# Altium schematic sheet Schematic .SchDoc
size B; SheetNumber: 1; SheetTotal: 1
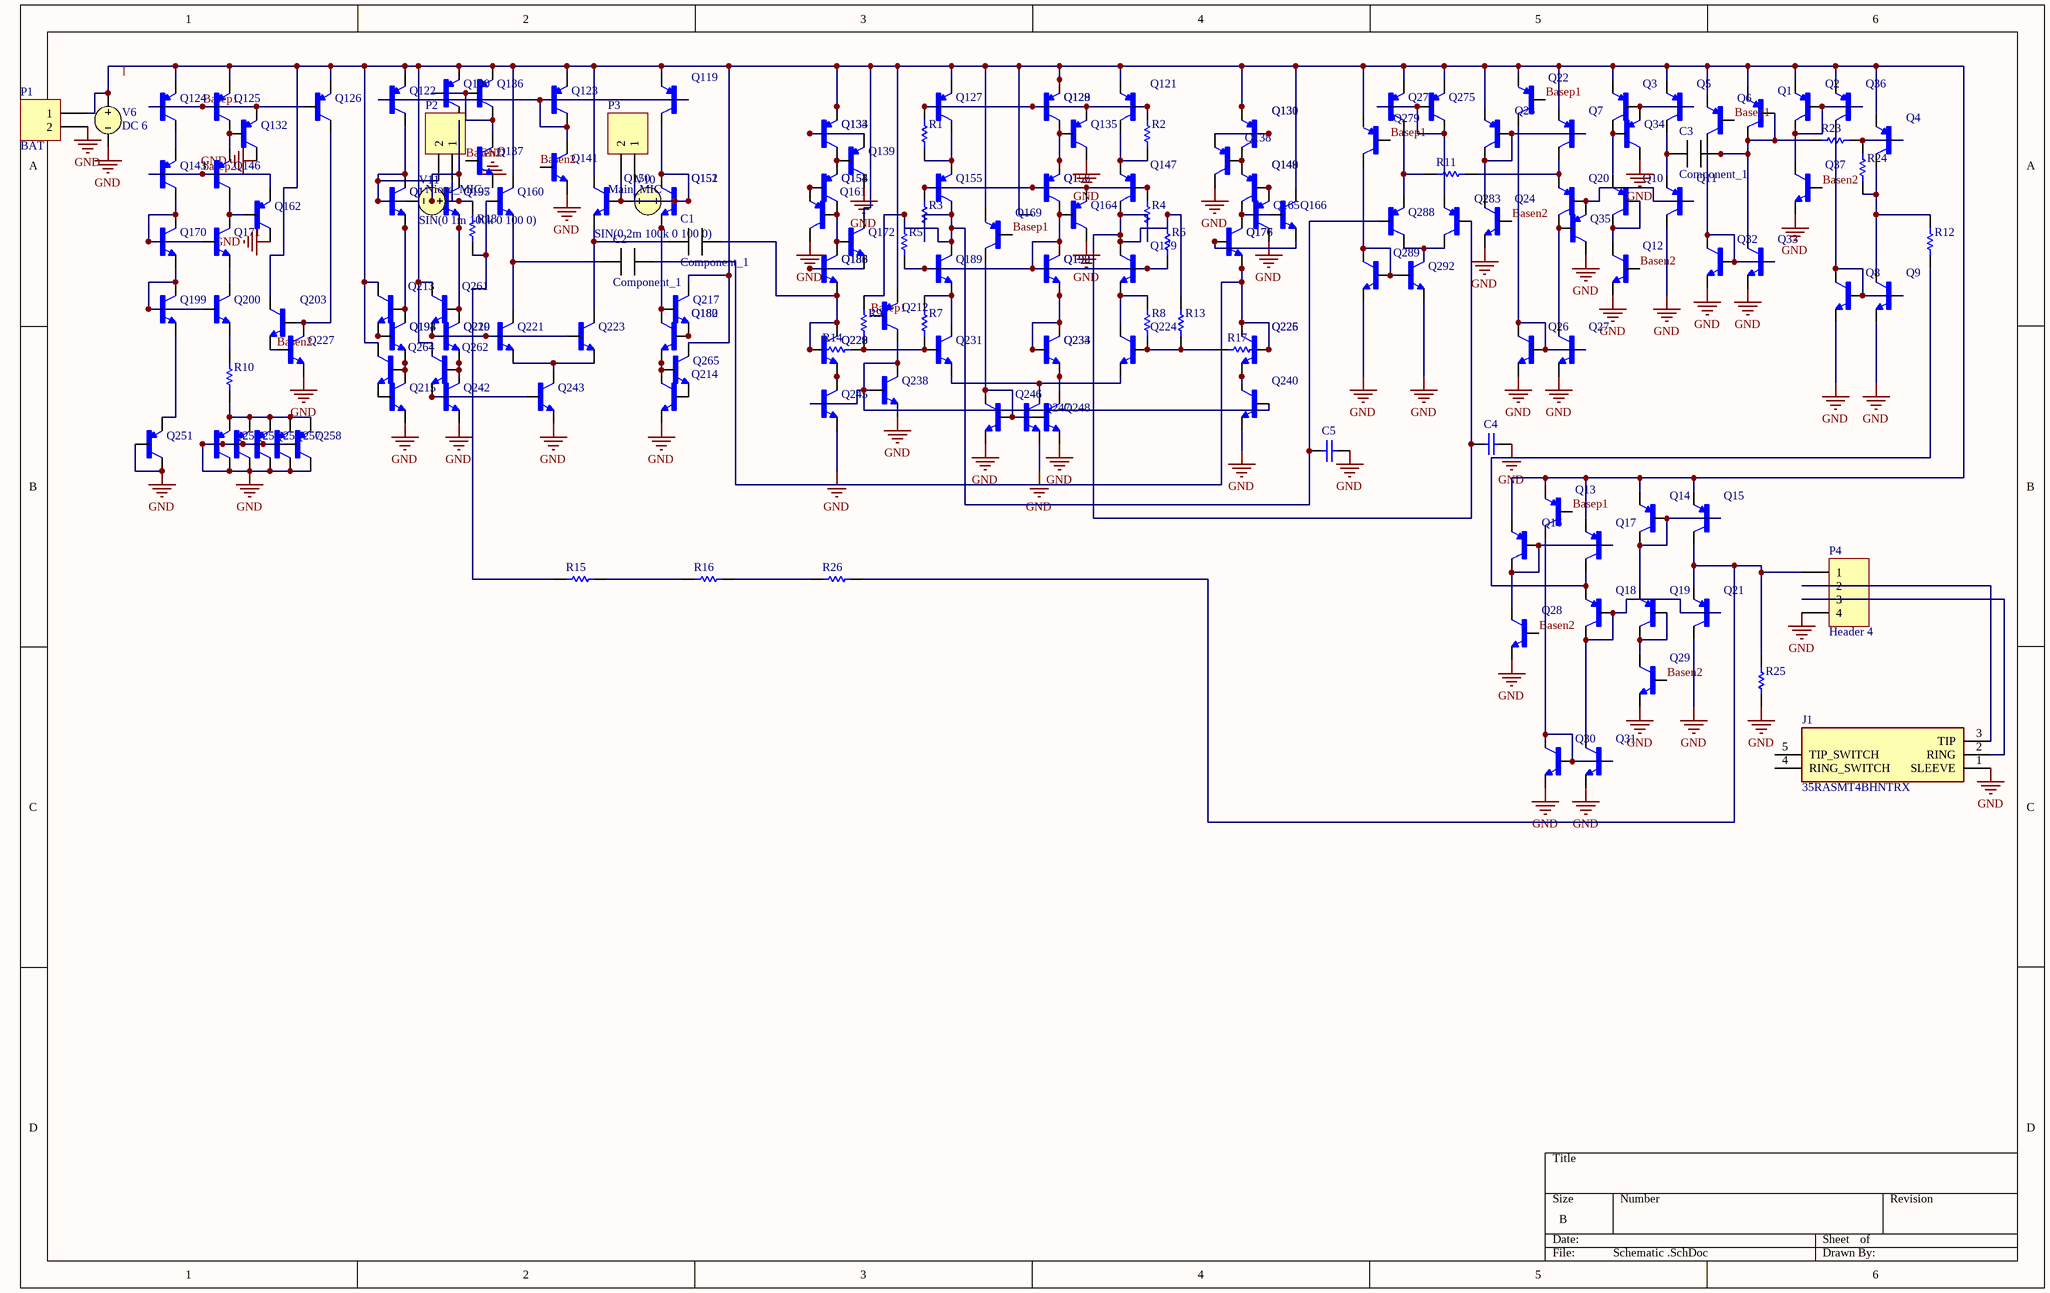
[diagram p0: Schematic .SchDoc]

## Parts
C1  Component_1  [PCBComponent_1]
C2  Component_1  [PCBComponent_1]
C3  Component_1  [PCBComponent_1]
C4  Cap  [RAD-0.3]  (value not drawn)
C5  Cap  [RAD-0.3]  (value not drawn)
J1  35RASMT4BHNTRX  [35RASMT4BHNTRX]
P1  BAT  [HDR1X2]
P2  Niose_MIC  [HDR1X2]
P3  Main_MIC  [HDR1X2]
P4  Header 4  [HDR1X4]
Q1  KSA992FTA  [PCBComponent_1]  (value not drawn)
Q2  KSA992FTA  [PCBComponent_1]  (value not drawn)
Q3  KSA992FTA  [PCBComponent_1]  (value not drawn)
Q4  KSA992FTA  [PCBComponent_1]  (value not drawn)
Q5  KSA992FTA  [PCBComponent_1]  (value not drawn)
Q6  BC560B  [TO92250P510H770-3]  (value not drawn)
Q7  KSA992FTA  [PCBComponent_1]  (value not drawn)
Q8  KSC1845FTA  [PCBComponent_1]  (value not drawn)
Q9  KSC1845FTA  [PCBComponent_1]  (value not drawn)
Q10  KSA992FTA  [PCBComponent_1]  (value not drawn)
Q11  KSA992FTA  [PCBComponent_1]  (value not drawn)
Q12  BC550B  [TO92250P510H770-3]  (value not drawn)
Q13  BC560B  [TO92250P510H770-3]  (value not drawn)
Q14  KSA992FTA  [PCBComponent_1]  (value not drawn)
Q15  KSA992FTA  [PCBComponent_1]  (value not drawn)
Q16  KSA992FTA  [PCBComponent_1]  (value not drawn)
Q17  KSA992FTA  [PCBComponent_1]  (value not drawn)
Q18  KSA992FTA  [PCBComponent_1]  (value not drawn)
Q19  KSA992FTA  [PCBComponent_1]  (value not drawn)
Q20  KSA992FTA  [PCBComponent_1]  (value not drawn)
Q21  KSA992FTA  [PCBComponent_1]  (value not drawn)
Q22  BC560B  [TO92250P510H770-3]  (value not drawn)
Q23  KSA992FTA  [PCBComponent_1]  (value not drawn)
Q24  BC550B  [TO92250P510H770-3]  (value not drawn)
Q26  KSC1845FTA  [PCBComponent_1]  (value not drawn)
Q27  KSC1845FTA  [PCBComponent_1]  (value not drawn)
Q28  BC550B  [TO92250P510H770-3]  (value not drawn)
Q29  BC550B  [TO92250P510H770-3]  (value not drawn)
Q30  KSC1845FTA  [PCBComponent_1]  (value not drawn)
Q31  KSC1845FTA  [PCBComponent_1]  (value not drawn)
Q32  KSC1845FTA  [PCBComponent_1]  (value not drawn)
Q33  KSC1845FTA  [PCBComponent_1]  (value not drawn)
Q34  KSA992FTA  [PCBComponent_1]  (value not drawn)
Q35  KSA992FTA  [PCBComponent_1]  (value not drawn)
Q36  KSA992FTA  [PCBComponent_1]  (value not drawn)
Q37  BC550B  [TO92250P510H770-3]  (value not drawn)
Q119  KSA992FTA  [PCBComponent_1]  (value not drawn)
Q120  KSA992FTA  [PCBComponent_1]  (value not drawn)
Q121  KSA992FTA  [PCBComponent_1]  (value not drawn)
Q122  KSA992FTA  [PCBComponent_1]  (value not drawn)
Q123  KSA992FTA  [PCBComponent_1]  (value not drawn)
Q124  BC560B  [TO92250P510H770-3]  (value not drawn)
Q125  BC560B  [TO92250P510H770-3]  (value not drawn)
Q126  BC560B  [TO92250P510H770-3]  (value not drawn)
Q127  KSA992FTA  [PCBComponent_1]  (value not drawn)
Q128  KSA992FTA  [PCBComponent_1]  (value not drawn)
Q129  KSA992FTA  [PCBComponent_1]  (value not drawn)
Q130  KSA992FTA  [PCBComponent_1]  (value not drawn)
Q131  KSA992FTA  [PCBComponent_1]  (value not drawn)
Q132  BC560B  [TO92250P510H770-3]  (value not drawn)
Q133  KSA992FTA  [PCBComponent_1]  (value not drawn)
Q134  KSA992FTA  [PCBComponent_1]  (value not drawn)
Q135  KSA992FTA  [PCBComponent_1]  (value not drawn)
Q136  KSA992FTA  [PCBComponent_1]  (value not drawn)
Q137  BC550B  [TO92250P510H770-3]  (value not drawn)
Q138  KSA992FTA  [PCBComponent_1]  (value not drawn)
Q139  KSA992FTA  [PCBComponent_1]  (value not drawn)
Q141  BC550B  [TO92250P510H770-3]  (value not drawn)
Q143  BC560B  [TO92250P510H770-3]  (value not drawn)
Q146  BC560B  [TO92250P510H770-3]  (value not drawn)
Q147  KSA992FTA  [PCBComponent_1]  (value not drawn)
Q148  KSA992FTA  [PCBComponent_1]  (value not drawn)
Q149  KSA992FTA  [PCBComponent_1]  (value not drawn)
Q150  KSC1845FTA  [PCBComponent_1]  (value not drawn)
Q151  KSC1845FTA  [PCBComponent_1]  (value not drawn)
Q152  KSC1845FTA  [PCBComponent_1]  (value not drawn)
Q153  KSA992FTA  [PCBComponent_1]  (value not drawn)
Q154  KSA992FTA  [PCBComponent_1]  (value not drawn)
Q155  KSA992FTA  [PCBComponent_1]  (value not drawn)
Q156  KSA992FTA  [PCBComponent_1]  (value not drawn)
Q157  KSA992FTA  [PCBComponent_1]  (value not drawn)
Q158  KSC1845FTA  [PCBComponent_1]  (value not drawn)
Q159  KSC1845FTA  [PCBComponent_1]  (value not drawn)
Q160  KSC1845FTA  [PCBComponent_1]  (value not drawn)
Q161  KSA992FTA  [PCBComponent_1]  (value not drawn)
Q162  BC560B  [TO92250P510H770-3]  (value not drawn)
Q164  KSA992FTA  [PCBComponent_1]  (value not drawn)
Q165  KSA992FTA  [PCBComponent_1]  (value not drawn)
Q166  KSC1845FTA  [PCBComponent_1]  (value not drawn)
Q169  BC560B  [TO92250P510H770-3]  (value not drawn)
Q170  BC550B  [TO92250P510H770-3]  (value not drawn)
Q171  BC550B  [TO92250P510H770-3]  (value not drawn)
Q172  KSC1845FTA  [PCBComponent_1]  (value not drawn)
Q176  KSC1845FTA  [PCBComponent_1]  (value not drawn)
Q177  KSC1845FTA  [PCBComponent_1]  (value not drawn)
Q179  KSC1845FTA  [PCBComponent_1]  (value not drawn)
Q180  KSC1845FTA  [PCBComponent_1]  (value not drawn)
Q182  KSC1845FTA  [PCBComponent_1]  (value not drawn)
Q183  KSC1845FTA  [PCBComponent_1]  (value not drawn)
Q186  KSC1845FTA  [PCBComponent_1]  (value not drawn)
Q189  KSC1845FTA  [PCBComponent_1]  (value not drawn)
Q190  KSC1845FTA  [PCBComponent_1]  (value not drawn)
Q192  KSC1845FTA  [PCBComponent_1]  (value not drawn)
Q193  KSC1845FTA  [PCBComponent_1]  (value not drawn)
Q194  KSC1845FTA  [PCBComponent_1]  (value not drawn)
Q195  KSC1845FTA  [PCBComponent_1]  (value not drawn)
Q197  KSC1845FTA  [PCBComponent_1]  (value not drawn)
Q199  BC550B  [TO92250P510H770-3]  (value not drawn)
Q200  BC550B  [TO92250P510H770-3]  (value not drawn)
Q203  BC550B  [TO92250P510H770-3]  (value not drawn)
Q212  BC560B  [TO92250P510H770-3]  (value not drawn)
Q213  KSC1845FTA  [PCBComponent_1]  (value not drawn)
Q214  KSC1845FTA  [PCBComponent_1]  (value not drawn)
Q215  KSC1845FTA  [PCBComponent_1]  (value not drawn)
Q217  KSC1845FTA  [PCBComponent_1]  (value not drawn)
Q219  KSC1845FTA  [PCBComponent_1]  (value not drawn)
Q220  KSC1845FTA  [PCBComponent_1]  (value not drawn)
Q221  KSC1845FTA  [PCBComponent_1]  (value not drawn)
Q223  KSC1845FTA  [PCBComponent_1]  (value not drawn)
Q224  KSC1845FTA  [PCBComponent_1]  (value not drawn)
Q225  KSC1845FTA  [PCBComponent_1]  (value not drawn)
Q226  KSC1845FTA  [PCBComponent_1]  (value not drawn)
Q227  BC550B  [TO92250P510H770-3]  (value not drawn)
Q228  KSC1845FTA  [PCBComponent_1]  (value not drawn)
Q229  KSC1845FTA  [PCBComponent_1]  (value not drawn)
Q231  KSC1845FTA  [PCBComponent_1]  (value not drawn)
Q233  KSC1845FTA  [PCBComponent_1]  (value not drawn)
Q234  KSC1845FTA  [PCBComponent_1]  (value not drawn)
Q238  KSC1845FTA  [PCBComponent_1]  (value not drawn)
Q240  KSC1845FTA  [PCBComponent_1]  (value not drawn)
Q242  KSC1845FTA  [PCBComponent_1]  (value not drawn)
Q243  KSC1845FTA  [PCBComponent_1]  (value not drawn)
Q245  KSC1845FTA  [PCBComponent_1]  (value not drawn)
Q246  KSC1845FTA  [PCBComponent_1]  (value not drawn)
Q247  KSC1845FTA  [PCBComponent_1]  (value not drawn)
Q248  KSC1845FTA  [PCBComponent_1]  (value not drawn)
Q251  BC560B  [TO92250P510H770-3]  (value not drawn)
Q252  BC560B  [TO92250P510H770-3]  (value not drawn)
Q254  BC560B  [TO92250P510H770-3]  (value not drawn)
Q255  BC560B  [TO92250P510H770-3]  (value not drawn)
Q257  BC560B  [TO92250P510H770-3]  (value not drawn)
Q258  BC560B  [TO92250P510H770-3]  (value not drawn)
Q261  KSC1845FTA  [PCBComponent_1]  (value not drawn)
Q262  KSC1845FTA  [PCBComponent_1]  (value not drawn)
Q264  KSC1845FTA  [PCBComponent_1]  (value not drawn)
Q265  KSC1845FTA  [PCBComponent_1]  (value not drawn)
Q274  KSA992FTA  [PCBComponent_1]  (value not drawn)
Q275  KSA992FTA  [PCBComponent_1]  (value not drawn)
Q279  BC560B  [TO92250P510H770-3]  (value not drawn)
Q283  KSA992FTA  [PCBComponent_1]  (value not drawn)
Q288  KSA992FTA  [PCBComponent_1]  (value not drawn)
Q289  KSC1845FTA  [PCBComponent_1]  (value not drawn)
Q292  KSC1845FTA  [PCBComponent_1]  (value not drawn)
R1  Res1  [AXIAL-0.3]  (value not drawn)
R2  Res1  [AXIAL-0.3]  (value not drawn)
R3  Res1  [AXIAL-0.3]  (value not drawn)
R4  Res1  [AXIAL-0.3]  (value not drawn)
R5  Res1  [AXIAL-0.3]  (value not drawn)
R6  Res1  [AXIAL-0.3]  (value not drawn)
R7  Res1  [AXIAL-0.3]  (value not drawn)
R8  Res1  [AXIAL-0.3]  (value not drawn)
R9  Res1  [AXIAL-0.3]  (value not drawn)
R10  Res1  [AXIAL-0.3]  (value not drawn)
R11  Res1  [AXIAL-0.3]  (value not drawn)
R12  Res1  [AXIAL-0.3]  (value not drawn)
R13  Res1  [AXIAL-0.3]  (value not drawn)
R14  Res1  [AXIAL-0.3]  (value not drawn)
R15  Res1  [PCBComponent_1]  (value not drawn)
R16  Res1  [PCBComponent_1]  (value not drawn)
R17  Res1  [AXIAL-0.3]  (value not drawn)
R18  Res1  [AXIAL-0.3]  (value not drawn)
R23  Res1  [AXIAL-0.3]  (value not drawn)
R24  Res1  [AXIAL-0.3]  (value not drawn)
R25  Res1  [AXIAL-0.3]  (value not drawn)
R26  Res1  [AXIAL-0.3]  (value not drawn)
V6  DC 6
V10  SIN(0 2m 100k 0 100 0)
V11  SIN(0 1m 100k 0 100 0)

## Nets
GND: C4.2 C5.2 J1.1(SLEEVE) P1.2 P4.4 Q8.1(E) Q9.1(E) Q11.2(C) Q12.3(E) Q21.2(C) Q24.3(E) Q26.1(E) Q27.1(E) Q28.3(E) Q29.3(E) Q30.1(E) Q31.1(E) Q32.1(E) Q33.1(E) Q34.2(C) Q35.2(C) Q37.3(E) Q132.1(C) Q135.2(C) Q137.3(E) Q138.2(C) Q139.2(C) Q141.3(E) Q161.2(C) Q162.1(C) Q164.2(C) Q165.2(C) Q214.1(E) Q215.1(E) Q227.3(E) Q238.1(E) Q240.1(E) Q242.1(E) Q243.1(E) Q245.1(E) Q246.1(E) Q247.1(E) Q248.1(E) Q251.1(C) Q251.2(B) Q252.1(C) Q252.2(B) Q254.1(C) Q254.2(B) Q255.1(C) Q255.2(B) Q257.1(C) Q257.2(B) Q258.1(C) Q258.2(B) Q289.1(E) Q292.1(E) R25.2 V6.2
Basen2: Q12.2(B) Q24.2(B) Q28.2(B) Q29.2(B) Q37.2(B) Q137.2(B) Q141.2(B) Q203.3(E) Q227.2(B)
Basep1: Q6.2(B) Q13.2(B) Q22.2(B) Q124.2(B) Q125.2(B) Q126.2(B) Q132.3(E) Q169.2(B) Q212.2(B) Q279.2(B)
basep2: Q143.2(B) Q146.2(B) Q162.3(E)
NetC1_1: C1.1 Q150.1(E) Q223.2(C)
NetC1_2: C1.2 Q183.1(E) Q186.1(E) Q228.2(C) Q228.3(B) Q229.2(C) Q229.3(B) R14.2
NetC2_1: C2.1 Q160.1(E) Q221.2(C)
NetC2_2: C2.2 Q176.1(E) Q177.1(E) Q225.2(C) Q225.3(B) Q226.2(C) Q226.3(B) R17.1
NetC3_1: C3.1 Q5.2(C) Q11.1(E)
NetC3_2: C3.2 Q1.2(C) Q1.3(B) Q33.2(C) R23.1
NetC4_1: C4.1 Q147.2(C) Q179.2(C) Q283.3(B) R4.1 R6.2 R13.2
NetC5_1: C5.1 Q155.2(C) Q189.2(C) Q288.3(B) R3.1 R5.2 R9.2
NetJ1_2: J1.2(RING) P4.3
NetJ1_3: J1.3(TIP) P4.2
NetP1_1: P1.1 Q1.1(E) Q2.1(E) Q3.1(E) Q4.1(E) Q5.1(E) Q6.3(E) Q7.1(E) Q13.3(E) Q14.1(E) Q15.1(E) Q16.1(E) Q17.1(E) Q22.3(E) Q23.1(E) Q36.1(E) Q119.1(E) Q120.1(E) Q121.1(E) Q122.1(E) Q123.1(E) Q124.3(E) Q125.3(E) Q126.3(E) Q127.1(E) Q128.1(E) Q129.1(E) Q130.1(E) Q131.1(E) Q133.1(E) Q134.1(E) Q136.1(E) Q150.2(C) Q160.2(C) Q166.2(C) Q169.3(E) Q172.2(C) Q203.1(C) Q212.3(E) Q213.2(C) Q217.2(C) Q261.2(C) Q262.2(C) Q264.2(C) Q265.2(C) Q274.1(E) Q275.1(E) Q279.3(E) V6.1
NetP2_1: P2.1 R18.1 V11.1
NetP2_2: P2.2 Q122.2(C) Q158.2(C) Q158.3(B) Q159.2(C) Q159.3(B) V11.2
NetP3_1: P3.1 Q119.2(C) Q151.2(C) Q151.3(B) Q152.2(C) Q152.3(B) V10.2
NetP3_2: P3.2 Q150.3(B) V10.1
NetP4_1: P4.1 Q15.2(C) Q21.1(E) R25.1 R26.2
NetQ2_2: Q2.2(C) Q2.3(B) Q36.3(B) Q37.1(C)
NetQ3_2: Q3.2(C) Q10.1(E) Q34.3(B)
NetQ3_3: Q3.3(B) Q5.3(B) Q34.1(E)
NetQ4_2: Q4.2(C) Q9.2(C) R12.1 R24.1
NetQ4_3: Q4.3(B) R23.2 R24.2
NetQ6_1: Q6.1(C) Q32.2(C) Q32.3(B) Q33.3(B)
NetQ7_2: Q7.2(C) Q20.1(E) R11.2
NetQ7_3: Q7.3(B) Q23.2(C) Q23.3(B) Q24.1(C)
NetQ8_2: Q8.2(C) Q8.3(B) Q9.3(B) Q36.2(C)
NetQ10_2: Q10.2(C) Q10.3(B) Q12.1(C)
NetQ11_3: Q11.3(B) Q20.3(B) Q35.1(E)
NetQ13_1: Q13.1(C) Q30.2(C) Q30.3(B) Q31.3(B)
NetQ14_2: Q14.2(C) Q14.3(B) Q15.3(B) Q19.1(E)
NetQ16_2: Q16.2(C) Q16.3(B) Q17.3(B) Q28.1(C)
NetQ17_2: Q17.2(C) Q18.1(E) R12.2
NetQ18_2: Q18.2(C) Q18.3(B) Q21.3(B) Q31.2(C)
NetQ19_2: Q19.2(C) Q19.3(B) Q29.1(C)
NetQ20_2: Q20.2(C) Q27.2(C) Q35.3(B)
NetQ22_1: Q22.1(C) Q26.2(C) Q26.3(B) Q27.3(B)
NetQ119_3: Q119.3(B) Q122.3(B) Q123.2(C) Q123.3(B) Q141.1(C)
NetQ120_2: Q120.2(C) Q195.2(C) Q195.3(B) Q197.2(C) Q197.3(B)
NetQ120_3: Q120.3(B) Q136.2(C) Q136.3(B) Q137.1(C)
NetQ121_2: Q121.2(C) Q147.1(E) R2.1
NetQ121_3: Q121.3(B) Q127.3(B) Q128.3(B) Q129.3(B) Q135.1(E) R1.2 R2.2
NetQ124_1: Q124.1(C) Q143.3(E)
NetQ125_1: Q125.1(C) Q132.2(B) Q146.3(E)
NetQ126_1: Q126.1(C) Q203.2(B) Q227.1(C)
NetQ127_2: Q127.2(C) Q155.1(E) R1.1
NetQ128_2: Q128.2(C) Q129.2(C) Q135.3(B) Q156.1(E) Q157.1(E)
NetQ130_2: Q130.2(C) Q131.2(C) Q138.3(B) Q148.1(E) Q149.1(E)
NetQ130_3: Q130.3(B) Q131.3(B) Q138.1(E)
NetQ133_2: Q133.2(C) Q134.2(C) Q139.3(B) Q153.1(E) Q154.1(E)
NetQ133_3: Q133.3(B) Q134.3(B) Q139.1(E)
NetQ143_1: Q143.1(C) Q170.1(C) Q170.2(B) Q171.2(B)
NetQ146_1: Q146.1(C) Q162.2(B) Q171.1(C)
NetQ147_3: Q147.3(B) Q155.3(B) Q156.3(B) Q157.3(B) Q164.1(E) R3.2 R4.2
NetQ148_2: Q148.2(C) Q149.2(C) Q165.3(B) Q166.3(B) Q176.2(C) Q177.2(C)
NetQ148_3: Q148.3(B) Q149.3(B) Q165.1(E)
NetQ151_1: Q151.1(E) Q152.1(E) Q180.2(C) Q182.2(C) Q217.3(B)
NetQ153_2: Q153.2(C) Q154.2(C) Q161.3(B) Q172.3(B) Q183.2(C) Q186.2(C)
NetQ153_3: Q153.3(B) Q154.3(B) Q161.1(E)
NetQ156_2: Q156.2(C) Q157.2(C) Q164.3(B) Q179.3(B) Q189.3(B) Q190.2(C) Q190.3(B) Q192.2(C) Q192.3(B) R5.1 R6.1
NetQ158_1: Q158.1(E) Q159.1(E) Q193.2(C) Q194.2(C) Q213.3(B)
NetQ160_3: Q160.3(B) R15.1 R18.2
NetQ166_1: Q166.1(E) Q176.3(B) Q177.3(B)
NetQ169_1: Q169.1(C) Q246.2(C) Q246.3(B) Q247.3(B) Q248.3(B)
NetQ170_3: Q170.3(E) Q199.1(C) Q199.2(B) Q200.2(B)
NetQ171_3: Q171.3(E) Q200.1(C)
NetQ172_1: Q172.1(E) Q183.3(B) Q186.3(B)
NetQ179_1: Q179.1(E) Q224.2(C) R8.2
NetQ180_1: Q180.1(E) Q182.1(E) Q214.2(C) Q265.3(B)
NetQ180_3: Q180.3(B) Q182.3(B) Q217.1(E)
NetQ189_1: Q189.1(E) Q231.2(C) R7.2
NetQ190_1: Q190.1(E) Q192.1(E) Q233.2(C) Q233.3(B) Q234.2(C) Q234.3(B)
NetQ193_1: Q193.1(E) Q194.1(E) Q215.2(C) Q264.3(B)
NetQ193_3: Q193.3(B) Q194.3(B) Q213.1(E)
NetQ195_1: Q195.1(E) Q197.1(E) Q219.2(C) Q220.2(C) Q261.3(B)
NetQ199_3: Q199.3(E) Q251.3(E)
NetQ200_3: Q200.3(E) R10.2
NetQ212_1: Q212.1(C) Q238.2(C) Q238.3(B) Q240.3(B) Q245.3(B)
NetQ214_3: Q214.3(B) Q265.1(E)
NetQ215_3: Q215.3(B) Q264.1(E)
NetQ219_1: Q219.1(E) Q220.1(E) Q242.2(C) Q262.3(B)
NetQ219_3: Q219.3(B) Q220.3(B) Q221.3(B) Q223.3(B) Q261.1(E)
NetQ221_1: Q221.1(E) Q223.1(E) Q243.2(C)
NetQ224_1: Q224.1(E) Q231.1(E) Q247.2(C)
NetQ224_3: Q224.3(B) R8.1 R13.1 R17.2
NetQ225_1: Q225.1(E) Q226.1(E) Q240.2(C)
NetQ228_1: Q228.1(E) Q229.1(E) Q245.2(C)
NetQ231_3: Q231.3(B) R7.1 R9.1 R14.1
NetQ233_1: Q233.1(E) Q234.1(E) Q248.2(C)
NetQ242_3: Q242.3(B) Q243.3(B) Q262.1(E)
NetQ252_3: Q252.3(E) Q254.3(E) Q255.3(E) Q257.3(E) Q258.3(E) R10.1
NetQ274_2: Q274.2(C) Q288.1(E) R11.1
NetQ274_3: Q274.3(B) Q275.2(C) Q275.3(B) Q283.1(E)
NetQ279_1: Q279.1(C) Q289.2(C) Q289.3(B) Q292.3(B)
NetQ283_2: Q283.2(C) Q288.2(C) Q292.2(C)
NetR15_2: R15.2 R16.1
NetR16_2: R16.2 R26.1

Not connected (* = marked no-connect by the designer): J1 4(RING_SWITCH) 5(TIP_SWITCH)

## Library data of the parts
C4 C5 = Cap: Capacitor; Value: 1pF; Published: 8-Jun-2000; LatestRevisionDate: 17-Jul-2002; LatestRevisionNote: Re-released for DXP Platform.; PackageReference: RAD-0.3; Publisher: Altium Limited; PackageDescription: Radial Cap, Thru-Hole; 2 Leads; 0.3 in Pin Spacing
J1 = 35RASMT4BHNTRX: Phone Connectors SMT 3.5MM PHONE JACK; Manufacturer_Name: Switchcraft; Geometry.Height: 5.127mm; Manufacturer_Part_Number: 35RASMT4BHNTRX; Mouser Part Number: 502-35RASMT4BHNTRX; Mouser Price/Stock: https://www.mouser.co.uk/ProductDetail/Switchcraft/35RASMT4BHNTRX?qs=iwvYsH9bSFa%252BoLnvLbECxQ%3D%3D; Arrow Part Number: 35RASMT4BHNTRX; Arrow Price/Stock: https://www.arrow.com/en/products/35rasmt4bhntrx/switchcraft?region=nac; Datasheet Link: https://www.arrow.com/en/products/35rasmt4bhntrx/switchcraft
P1-P3 = Header 2: Header, 2-Pin; LatestRevisionDate: 17-Jul-2002; LatestRevisionNote: Re-released for DXP Platform.; Publisher: Altium Limited
P4 = Header 4: Header, 4-Pin; LatestRevisionDate: 17-Jul-2002; LatestRevisionNote: Re-released for DXP Platform.; Publisher: Altium Limited
Q1-Q5 Q7 Q10 Q11 Q14-Q21 Q23 Q34-Q36 Q119-Q123 Q127-Q131 Q133-Q136 Q138 Q139 Q147-Q149 Q153-Q157 Q161 Q164 Q165 Q274 Q275 Q283 Q288 = KSA992FTA: TO-92, 120V, 0.05A,VA=100V,small signal PNP Bipolar Transistor; MP: BC337-40 A1G; MF: Taiwan Semiconductor; Value: *; SnapEDA_Link: https://www.snapeda.com/parts/BC337-40%20A1G/Taiwan+Semiconductor/view-part/?ref=snap; Purchase-URL: https://pricing.snapeda.com/search/part/BC337-40 A1G/?ref=eda; Check_prices: https://www.snapeda.com/parts/BC337-40%20A1G/Taiwan+Semiconductor/view-part/?ref=eda; Availability: In Stock; Price: None; Package: TO-92 Taiwan Semiconductor
Q6 Q13 Q22 Q124-Q126 Q132 Q143 Q146 Q162 Q169 Q212 Q251 Q252 Q254 Q255 Q257 Q258 Q279 = BC560B: TO-92, 45V, 0.1A, PNP Bipolar Transistor; MP: BC337-40 A1G; MF: Taiwan Semiconductor; Value: *; SnapEDA_Link: https://www.snapeda.com/parts/BC337-40%20A1G/Taiwan+Semiconductor/view-part/?ref=snap; Purchase-URL: https://pricing.snapeda.com/search/part/BC337-40 A1G/?ref=eda; Check_prices: https://www.snapeda.com/parts/BC337-40%20A1G/Taiwan+Semiconductor/view-part/?ref=eda; Availability: In Stock; Price: None; Package: TO-92 Taiwan Semiconductor
Q8 Q9 Q26 Q27 Q30-Q33 Q150-Q152 Q158-Q160 Q166 Q172 Q176 Q177 Q179 Q180 Q182 Q183 Q186 Q189 Q190 Q192-Q195 Q197 Q213-Q215 Q217 Q219-Q221 Q223-Q226 Q228 Q229 Q231 Q233 Q234 Q238 Q240 Q242 Q243 Q245-Q248 Q261 Q262 Q264 Q265 Q289 Q292 = KSC1845FTA: TO-92, 120V, 0.05A,150VA,small signall NPN Bipolar Transistor; MP: BC337-40 A1G; MF: Taiwan Semiconductor; Value: *; SnapEDA_Link: https://www.snapeda.com/parts/BC337-40%20A1G/Taiwan+Semiconductor/view-part/?ref=snap; Purchase-URL: https://pricing.snapeda.com/search/part/BC337-40 A1G/?ref=eda; Check_prices: https://www.snapeda.com/parts/BC337-40%20A1G/Taiwan+Semiconductor/view-part/?ref=eda; Availability: In Stock; Price: None; Package: TO-92 Taiwan Semiconductor
Q12 Q24 Q28 Q29 Q37 Q137 Q141 Q170 Q171 Q199 Q200 Q203 Q227 = BC550B: TO-92, 45V, 0.1A, NPN Bipolar Transistor; MP: BC337-40 A1G; MF: Taiwan Semiconductor; Value: *; SnapEDA_Link: https://www.snapeda.com/parts/BC337-40%20A1G/Taiwan+Semiconductor/view-part/?ref=snap; Purchase-URL: https://pricing.snapeda.com/search/part/BC337-40 A1G/?ref=eda; Check_prices: https://www.snapeda.com/parts/BC337-40%20A1G/Taiwan+Semiconductor/view-part/?ref=eda; Availability: In Stock; Price: None; Package: TO-92 Taiwan Semiconductor
R1-R8 = Res1: Resistor; Value: 600k; Published: 8-Jun-2000; LatestRevisionDate: 17-Jul-2002; LatestRevisionNote: Re-released for DXP Platform.; PackageReference: AXIAL-0.3; Publisher: Altium Limited; PackageDescription: Axial Device, Thru-Hole; 2 Leads; 0.3 in Pin Spacing
R9 R13 = Res1: Resistor; Value: 100k; Published: 8-Jun-2000; LatestRevisionDate: 17-Jul-2002; LatestRevisionNote: Re-released for DXP Platform.; PackageReference: AXIAL-0.3; Publisher: Altium Limited; PackageDescription: Axial Device, Thru-Hole; 2 Leads; 0.3 in Pin Spacing
R10 = Res1: Resistor; Value: 20; Published: 8-Jun-2000; LatestRevisionDate: 17-Jul-2002; LatestRevisionNote: Re-released for DXP Platform.; PackageReference: AXIAL-0.3; Publisher: Altium Limited; PackageDescription: Axial Device, Thru-Hole; 2 Leads; 0.3 in Pin Spacing
R11 R12 = Res1: Resistor; Value: 5k; Published: 8-Jun-2000; LatestRevisionDate: 17-Jul-2002; LatestRevisionNote: Re-released for DXP Platform.; PackageReference: AXIAL-0.3; Publisher: Altium Limited; PackageDescription: Axial Device, Thru-Hole; 2 Leads; 0.3 in Pin Spacing
R14 R17 = Res1: Resistor; Value: 1K; Published: 8-Jun-2000; LatestRevisionDate: 17-Jul-2002; LatestRevisionNote: Re-released for DXP Platform.; PackageReference: AXIAL-0.3; Publisher: Altium Limited; PackageDescription: Axial Device, Thru-Hole; 2 Leads; 0.3 in Pin Spacing
R15 = Res1: Resistor; Value: 9Meg; Published: 8-Jun-2000; LatestRevisionDate: 17-Jul-2002; LatestRevisionNote: Re-released for DXP Platform.; PackageReference: AXIAL-0.3; Publisher: Altium Limited; PackageDescription: Axial Device, Thru-Hole; 2 Leads; 0.3 in Pin Spacing
R16 R26 = Res1: Resistor; Value: 1Meg; Published: 8-Jun-2000; LatestRevisionDate: 17-Jul-2002; LatestRevisionNote: Re-released for DXP Platform.; PackageReference: AXIAL-0.3; Publisher: Altium Limited; PackageDescription: Axial Device, Thru-Hole; 2 Leads; 0.3 in Pin Spacing
R18 = Res1: Resistor; Value: 10K; Published: 8-Jun-2000; LatestRevisionDate: 17-Jul-2002; LatestRevisionNote: Re-released for DXP Platform.; PackageReference: AXIAL-0.3; Publisher: Altium Limited; PackageDescription: Axial Device, Thru-Hole; 2 Leads; 0.3 in Pin Spacing
R23 = Res1: Resistor; Value: 100; Published: 8-Jun-2000; LatestRevisionDate: 17-Jul-2002; LatestRevisionNote: Re-released for DXP Platform.; PackageReference: AXIAL-0.3; Publisher: Altium Limited; PackageDescription: Axial Device, Thru-Hole; 2 Leads; 0.3 in Pin Spacing
R24 = Res1: Resistor; Value: 33k; Published: 8-Jun-2000; LatestRevisionDate: 17-Jul-2002; LatestRevisionNote: Re-released for DXP Platform.; PackageReference: AXIAL-0.3; Publisher: Altium Limited; PackageDescription: Axial Device, Thru-Hole; 2 Leads; 0.3 in Pin Spacing
R25 = Res1: Resistor; Value: 11k; Published: 8-Jun-2000; LatestRevisionDate: 17-Jul-2002; LatestRevisionNote: Re-released for DXP Platform.; PackageReference: AXIAL-0.3; Publisher: Altium Limited; PackageDescription: Axial Device, Thru-Hole; 2 Leads; 0.3 in Pin Spacing
V6 = VSRC: Voltage Source; Note: PCB Footprint - Not required; AC Magnitude: 1; AC Phase: 0; Value: 6; Published: 8-Jun-2000; LatestRevisionDate: 17-Jul-2002; LatestRevisionNote: Re-released for DXP Platform.; PackageReference: Not Applicable; Publisher: Altium Limited
V10 V11 = VSRC: Voltage Source; Note: PCB Footprint - Not required; AC Magnitude: 0; Damping Factor: 100; Published: 8-Jun-2000; LatestRevisionDate: 17-Jul-2002; LatestRevisionNote: Re-released for DXP Platform.; PackageReference: Not Applicable; Publisher: Altium Limited; AC Phase: 0; DC Magnitude: 0; Offset: 0; Frequency: 100k; Delay: 0; Phase: 0
  V10: Amplitude: 2m
  V11: Amplitude: 1m